# Altium schematic sheet Sheet2.SchDoc
size A
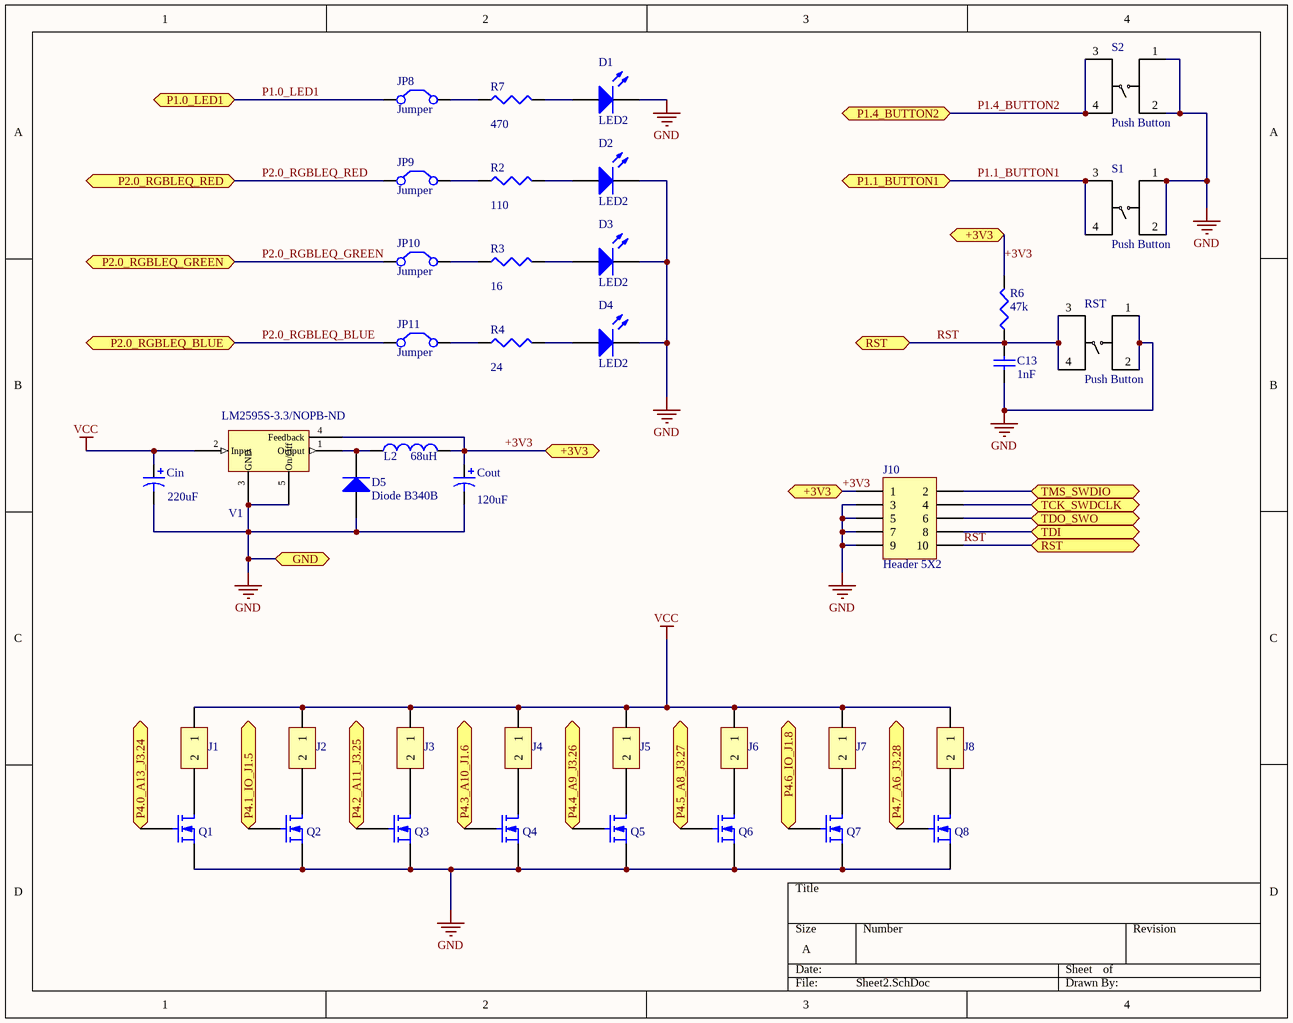
[diagram p0: Sheet2.SchDoc]

## Parts
C13  value 1nF  [0402]  (hidden comment: Cap Semi)
Cin  value 220uF  [C0805]  (hidden comment: Cap Pol3)
Cout  value 120uF  [C0805]  (hidden comment: Cap Pol3)
D1  LED2  [3.2X1.6X1.1]
D2  LED2  [3.2X1.6X1.1]
D3  LED2  [3.2X1.6X1.1]
D4  LED2  [3.2X1.6X1.1]
D5  Diode B340B  [SMB]
J1  MOLEX 2CKT Header  [MOLEX 2CKT Header]  (value not drawn)
J2  MOLEX 2CKT Header  [MOLEX 2CKT Header]  (value not drawn)
J3  MOLEX 2CKT Header  [MOLEX 2CKT Header]  (value not drawn)
J4  MOLEX 2CKT Header  [MOLEX 2CKT Header]  (value not drawn)
J5  MOLEX 2CKT Header  [MOLEX 2CKT Header]  (value not drawn)
J6  MOLEX 2CKT Header  [MOLEX 2CKT Header]  (value not drawn)
J7  MOLEX 2CKT Header  [MOLEX 2CKT Header]  (value not drawn)
J8  MOLEX 2CKT Header  [MOLEX 2CKT Header]  (value not drawn)
J10  Header 5X2  [HDR2X5]
JP8  Jumper  [HDR1X2]
JP9  Jumper  [HDR1X2]
JP10  Jumper  [HDR1X2]
JP11  Jumper  [HDR1X2]
L2  value 68uH  [0402-A]  (hidden comment: Inductor)
Q1  MOSFET-N  [SiUD41ED]  (value not drawn)
Q2  MOSFET-N  [SiUD41ED]  (value not drawn)
Q3  MOSFET-N  [SiUD41ED]  (value not drawn)
Q4  MOSFET-N  [SiUD41ED]  (value not drawn)
Q5  MOSFET-N  [SiUD41ED]  (value not drawn)
Q6  MOSFET-N  [SiUD41ED]  (value not drawn)
Q7  MOSFET-N  [SiUD41ED]  (value not drawn)
Q8  MOSFET-N  [SiUD41ED]  (value not drawn)
R2  value 110  [J1-0603]  (hidden comment: Res3)
R3  value 16  [J1-0603]  (hidden comment: Res3)
R4  value 24  [J1-0603]  (hidden comment: Res3)
R6  value 47k  [J1-0603]  (hidden comment: Res3)
R7  value 470  [J1-0603]  (hidden comment: Res3)
RST  Push Button  [Push Button]
S1  Push Button  [Push Button]
S2  Push Button  [Push Button]
V1  LM2595S-3.3/NOPB-ND  [LM2595S-3.3/NOPB-ND]

## Ports
+3V3, GND, P1.0_LED1, P1.1_BUTTON1, P1.4_BUTTON2, P2.0_RGBLEQ_BLUE, P2.0_RGBLEQ_GREEN, P2.0_RGBLEQ_RED, P4.0_A13_J3.24, P4.1_IO_J1.5, P4.2_A11_J3.25, P4.3_A10_J1.6, P4.4_A9_J3.26, P4.5_A8_J3.27, P4.6_IO_J1.8, P4.7_A6_J3.28, RST, TCK_SWDCLK, TDI, TDO_SWO, TMS_SWDIO

## Nets
GND: C13.1 Cin.2 Cout.2 D1.2(K) D2.2(K) D3.2(K) D4.2(K) D5.1(A) J10.3 J10.5 J10.7 J10.9 Q1.2 Q2.2 Q3.2 Q4.2 Q5.2 Q6.2 Q7.2 Q8.2 RST.1 RST.2 S1.1 S1.2 S2.1 S2.2 V1.3(GND) V1.5(On/Off) ; port GND
VCC: Cin.1 J1.1 J2.1 J3.1 J4.1 J5.1 J6.1 J7.1 J8.1 V1.2(Input)
+3V3: Cout.1 J10.1 L2.2 R6.2 V1.4(Feedback) ; port +3V3
P1.0_LED1: JP8.1(C1) ; port P1.0_LED1
P1.1_BUTTON1: S1.3 S1.4 ; port P1.1_BUTTON1
P1.4_BUTTON2: S2.3 S2.4 ; port P1.4_BUTTON2
P2.0_RGBLEQ_BLUE: JP11.1(C1) ; port P2.0_RGBLEQ_BLUE
P2.0_RGBLEQ_GREEN: JP10.1(C1) ; port P2.0_RGBLEQ_GREEN
P2.0_RGBLEQ_RED: JP9.1(C1) ; port P2.0_RGBLEQ_RED
P4.0_A13_J3.24: Q1.1 ; port P4.0_A13_J3.24
P4.1_IO_J1.5: Q2.1 ; port P4.1_IO_J1.5
P4.2_A11_J3.25: Q3.1 ; port P4.2_A11_J3.25
P4.3_A10_J1.6: Q4.1 ; port P4.3_A10_J1.6
P4.4_A9_J3.26: Q5.1 ; port P4.4_A9_J3.26
P4.5_A8_J3.27: Q6.1 ; port P4.5_A8_J3.27
P4.6_IO_J1.8: Q7.1 ; port P4.6_IO_J1.8
P4.7_A6_J3.28: Q8.1 ; port P4.7_A6_J3.28
RST: C13.2 J10.10 R6.1 RST.3 RST.4 ; port RST
TCK_SWDCLK: J10.4 ; port TCK_SWDCLK
TDI: J10.8 ; port TDI
TDO_SWO: J10.6 ; port TDO_SWO
TMS_SWDIO: J10.2 ; port TMS_SWDIO
NetD1_1: D1.1(A) R7.2
NetD2_1: D2.1(A) R2.2
NetD3_1: D3.1(A) R3.2
NetD4_1: D4.1(A) R4.2
NetD5_2: D5.2(K) L2.1 V1.1(Output)
NetJ1_2: J1.2 Q1.3
NetJ2_2: J2.2 Q2.3
NetJ3_2: J3.2 Q3.3
NetJ4_2: J4.2 Q4.3
NetJ5_2: J5.2 Q5.3
NetJ6_2: J6.2 Q6.3
NetJ7_2: J7.2 Q7.3
NetJ8_2: J8.2 Q8.3
NetJP8_2: JP8.2(C2) R7.1
NetJP9_2: JP9.2(C2) R2.1
NetJP10_2: JP10.2(C2) R3.1
NetJP11_2: JP11.2(C2) R4.1

## Library data of the parts
C13 = Cap Semi: Capacitor (Semiconductor SIM Model); Published: 8-Jun-2000; LatestRevisionDate: 29-May-2009; LatestRevisionNote: IPC-7351 Footprint Added.; PackageReference: C1206; Publisher: Altium Limited; PackageDescription: Chip Capacitor
Cin Cout = Cap Pol3: Polarized Capacitor (Surface Mount); Published: 8-Jun-2000; LatestRevisionDate: 29-May-2009; LatestRevisionNote: IPC-7351 Footprint Added.; PackageReference: C0805; Publisher: Altium Limited; PackageDescription: Chip Capacitor
D1-D4 = LED2: Typical RED, GREEN, YELLOW, AMBER GaAs LED; Published: 8-Jun-2000; LatestRevisionDate: 17-Jul-2002; LatestRevisionNote: Re-released for DXP Platform.; PackageVersion: Feb-2002; PackageReference: 3.2X1.6X1.1; Publisher: Altium Limited; PackageDescription: SM LED; 2 Flat Leads
D5 = Diode: Default Diode; Published: 8-Jun-2000; LatestRevisionDate: 17-Jul-2002; LatestRevisionNote: Re-released for DXP Platform.; PackageVersion: Sep-1996; PackageReference: SMC; Publisher: Altium Limited; PackageDescription: DO-214-AB/SMC; 2 C-Bend Leads; Body 7.9 x 5.9 mm, inc. leads (LxW); Code_JEDEC: DO-214-AB
J10 = Header 5X2: Header, 5-Pin, Dual row; LatestRevisionDate: 17-Jul-2002; LatestRevisionNote: Re-released for DXP Platform.; Publisher: Altium Limited
JP8-JP11 = Jumper: Jumper Wire; Published: 24-Mar-1999; LatestRevisionDate: 17-Jul-2002; LatestRevisionNote: Re-released for DXP Platform.; PackageReference: RAD-0.2; Publisher: Altium Limited; PackageDescription: Radial Cap, Thru-Hole; 2 Leads; 0.2 in Pin Spacing
L2 = Inductor: Code_IEC: 1005; Published: 8-Jun-2000; LatestRevisionDate: 29-May-2009; LatestRevisionNote: IPC-7351 Footprint Added.; PackageReference: 0402-A; Publisher: Altium Limited; PackageDescription: Chip Inductor; Code_JEITA: 0402
Q1-Q8 = SiUD41ED
R2-R4 R6 R7 = Res3: Resistor; Published: 8-Jun-2000; LatestRevisionDate: 29-May-2009; LatestRevisionNote: IPC-7351 Footprint Added.; PackageReference: J1-0603; Publisher: Altium Limited; PackageDescription: Chip Resistor